# EAGLE design relaycircuit (EAGLE 7.5.0)
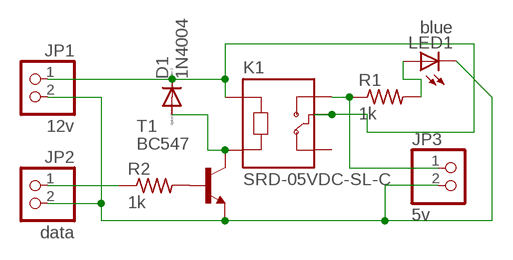
[diagram p0: schematic, sheet 1]

## Parts
D1  1N4004  [DO41-10]
JP1  12v  PINHD-1X2  [1X02]
JP2  data  PINHD-1X2  [1X02]
JP3  5v  PINHD-1X2  [1X02]
K1  SRD-05VDC-SL-C  [RELAY_SRD-05VDC-SL-C]
LED1  blue  LED5MM  [LED5MM]
R1  1k  R-US_0207/10  [0207/10]
R2  1k  R-US_0207/10  [0207/10]
T1  BC547  [TO92]

## Nets
N$1: JP3.1 K1.NO R1.1
N$2: R2.2 T1.2(B)
N$3: D1.A K1.A2 T1.3(C)
N$4: LED1.A R1.2
N$6: JP1.2 JP2.2 JP3.2 LED1.K(C) T1.1(E)
N$7: JP2.1 R2.1
N$8: D1.C JP1.1 K1.A1 K1.COM
Unconnected: K1.NC

## Library data of the parts
D1 = diode:1N4004: DIODE general purpose rectifier, 1 A
JP1-JP3 = pinhead:PINHD-1X2: PIN HEADER
K1 = SRD-05VDC-SL-C (1):SRD-05VDC-SL-C: 5V Trigger Relay Module For Arduino And Raspberry Pi 5V Trigger Relay Module For Arduino And Raspberry Pi Check availability <https://pricing.snapeda.com/parts/SRD-05VDC-SL-C/Songle%20Relay/view-part?ref=eda>; AVAILABILITY: Not in stock; DESCRIPTION: 5V Trigger Relay Module For Arduino And Raspberry Pi 5V Trigger Relay Module For Arduino And Raspberry Pi; MF: Songle Relay; MP: SRD-05VDC-SL-C; PACKAGE: None; PRICE: None
LED1 = led:LED: LED OSRAM: - CHIPLED LG R971, LG N971, LY N971, LG Q971, LY Q971, LO R971, LY R971 LH N974, LH R974 LS Q976, LO Q976, LY Q976 LO Q996 - Hyper CHIPLED LW Q18S LB Q993, LB Q99A, LB R99A - SideLED LS A670, LO A670, LY A670, LG A670, LP A670 LB A673, LV A673, LT A673, LW A673 LH A674 LY A675 LS A676, LA A676, LO A676, LY A676, LW A676 LS A679, LY A679, LG A679 - Hyper Micro SIDELED® LS Y876, LA Y876, LO Y876, LY Y876 LT Y87S - SmartLED LW L88C, LW L88S LB L89C, LB L89S, LG L890 LS L89K, LO L89K, LY L89K LS L896, LA L896, LO L896, LY L896 - TOPLED LS T670, LO T670, LY T670, LG T670, LP T670 LSG T670, LSP T670, LSY T670, LOP T670, LYG T670 LG T671, LOG T671, LSG T671 LB T673, LV T673, LT T673, LW T673 LH T674 LS T676, LA T676, LO T676, LY T676, LB T676, LH T676, LSB T676, LW T676 LB T67C, LV T67C, LT T67C, LS T67K, LO T67K, LY T67K, LW E67C LS E67B, LA E67B, LO E67B, LY E67B, LB E67C, LV E67C, LT E67C LW T67C LS T679, LY T679, LG T679 LS T770, LO T770, LY T770, LG T770, LP T770 LB T773, LV T773, LT T773, LW T773 LH T774 LS E675, LA E675, LY E675, LS T675 LS T776, LA T776, LO T776, LY T776, LB T776 LHGB T686 LT T68C, LB T68C - Hyper Mini TOPLED® LB M676 - Mini TOPLED Santana® LG M470 LS M47K, LO M47K, LY M47K Source: http://www.osram.convergy.de LUXEON: - LUMILED® LXK2-PW12-R00, LXK2-PW12-S00, LXK2-PW14-U00, LXK2-PW14-V00 LXK2-PM12-R00, LXK2-PM12-S00, LXK2-PM14-U00 LXK2-PE12-Q00, LXK2-PE12-R00, LXK2-PE12-S00, LXK2-PE14-T00, LXK2-PE14-U00 LXK2-PB12-K00, LXK2-PB12-L00, LXK2-PB12-M00, LXK2-PB14-N00, LXK2-PB14-P00, LXK2-PB14-Q00 LXK2-PR12-L00, LXK2-PR12-M00, LXK2-PR14-Q00, LXK2-PR14-R00 LXK2-PD12-Q00, LXK2-PD12-R00, LXK2-PD12-S00 LXK2-PH12-R00, LXK2-PH12-S00 LXK2-PL12-P00, LXK2-PL12-Q00, LXK2-PL12-R00 Source: www.luxeon.com KINGBRIGHT: KA-3528ASYC Source: www.kingbright.com
R1 R2 = rcl:R-US_: RESISTOR, American symbol
T1 = transistor:BC547: NPN TRANSISTOR

## Board
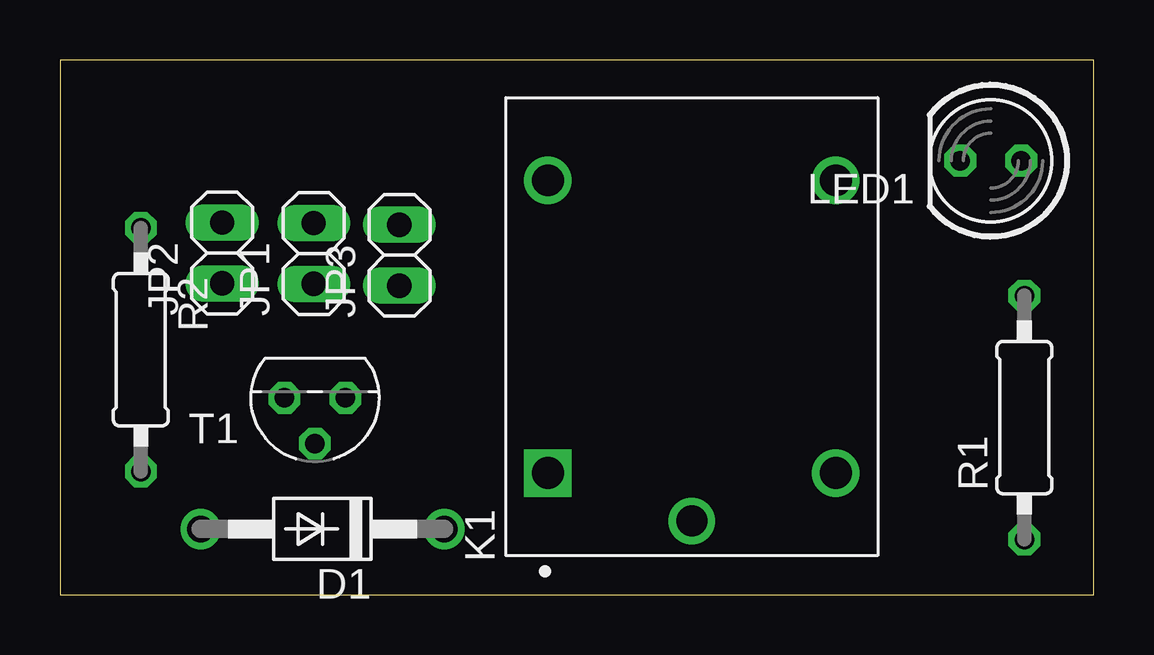
[diagram p1: board, top side]
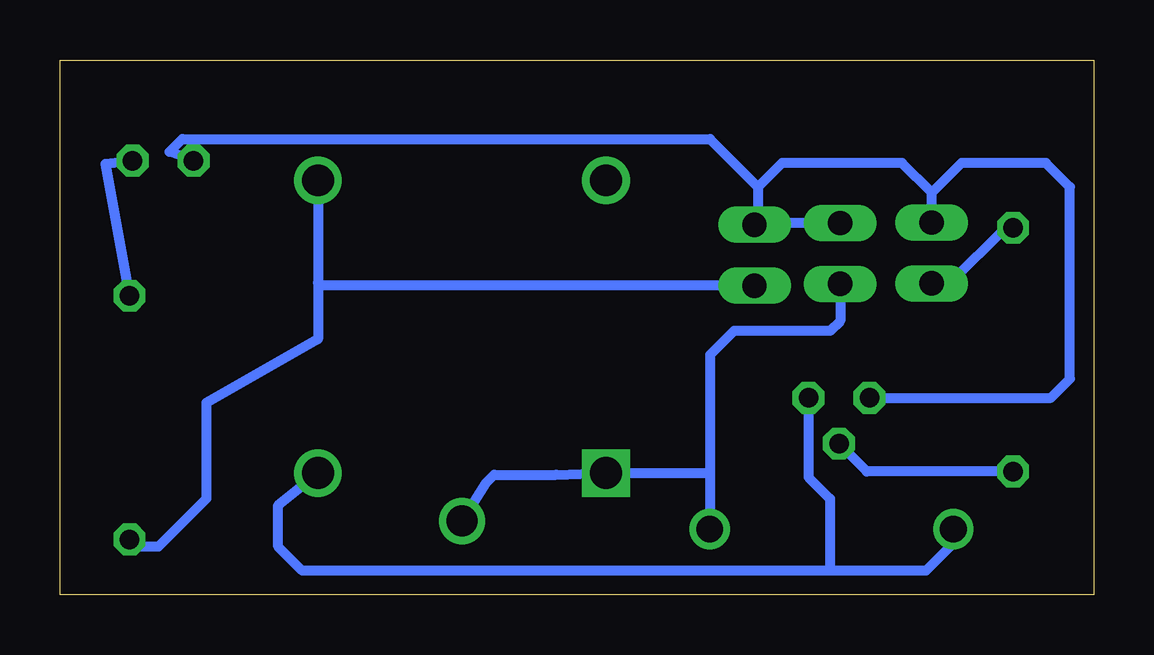
[diagram p2: board, bottom side, seen from below]

Size 43.1 x 22.3 mm. Coordinates in mm from the lower left corner, seen from the top.
Outline: 0,0 43.1,0 43.1,22.3 0,22.3 0,0
Copper layers (1*16): Top 0.035mm / dielectric 1.5mm / Bottom 0.035mm
Design rules "default": minimum track width 10mil, minimum drill 24mil, track to track 8mil, track to pad 8mil, pad to pad 8mil, via to via 8mil, smd to smd 8mil, copper to edge 40mil, drill to drill 8mil, minimum pad ring 10mil, minimum via ring 8mil, stop-mask expansion 4mil, vias tented up to drill 0mil, thermal gap 10mil

### Footprints (pad centres in the part's own frame; a part is rotated, then mirrored left to right if it is on the bottom)
DO41-10 = drill 1.118: A 5.08,0; C -5.08,0
1X02 = drill 1.016 long: 1 -1.27,0; 2 1.27,0
RELAY_SRD-05VDC-SL-C = drill 1.32 square: A1 -6.1,6 | drill 1.32: A2 -6.1,-6; NC 6.1,6; NO 6.1,-6 | drill 1.29: COM -8.1,0
LED5MM = drill 0.813 octagon: A -1.27,0; K 1.27,0
0207/10 = drill 0.813 octagon: 1 -5.08,0; 2 5.08,0
TO92 = drill 0.813 octagon: 1 1.27,0; 2 0,1.905; 3 -1.27,0

### Placement (x,y rotation side)
D1  10.94,2.74 180 top
JP1  10.57,14.23 90 top
JP2  6.76,14.25 90 top
JP3  14.15,14.16 90 top
K1  26.34,11.18 90 top
LED1  38.8,18.1 180 top
R1  40.2,7.39 90 top
R2  3.37,10.22 270 top
T1  10.63,8.21 180 top

### Tracks (layer width: path | path; a pad name or v marks a point on that pad's centre or on a via)
N$1
  Bottom 0.406: K1.NO 32.34,13 | 32.34,13 32.34,10.66 37,8 37,4 39,2 39.89,2 R1.1 | JP3.1 32.23,12.88 32.34,13
N$2
  Bottom 0.406: R2.2 9.46,5.14 T1.2
N$3
  Bottom 0.406: D1.A 5.86,2.14 7,1 11,1 | 11,1 33,1 34,2 34,3.74 K1.A2 | T1.3 11.9,4.9 11,4 11,1
N$4
  Bottom 0.406: R1.2 41.2,17.97 LED1.A
N$6
  Bottom 0.406: JP2.2 6.76,16.76 | 6.76,16.76 8,18 13,18 14,17 | 14,17 14,15.58 JP3.2 14.07,15.5 JP1.2 | T1.1 1.79,8.21 1,9 1,17 2,18 5.52,18 6.76,16.76 | LED1.K 38.53,18.47 38,19 16,19 14,17
N$7
  Bottom 0.406: R2.1 3.7,15.3 6,13 6.74,13 JP2.1
N$8
  Bottom 0.406: K1.COM 25.34,4.66 25,5 22.42,5 K1.A1 16.08,5.08 16,5 | JP1.1 10.57,11.42 11,11 15,11 16,10 16,5 | 16,5 16,2.76 D1.C